# Altium schematic sheet BRZ_PDU.SchDoc
size C; SheetNumber: 1; SheetTotal: 4
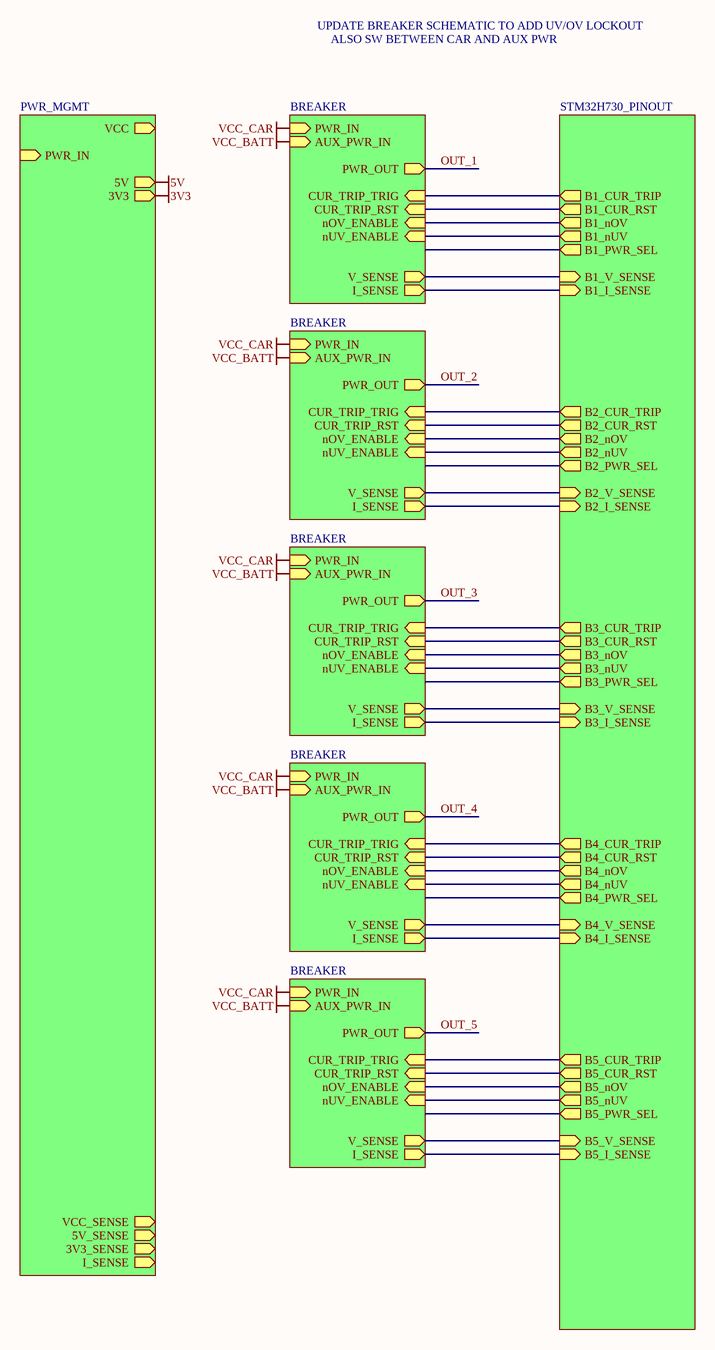
[diagram p0: BRZ_PDU.SchDoc]

## Sub-sheets
BREAKER_0 = BREAKER: PWR_IN (in), PWR_OUT (out), CUR_TRIP_RST (in), V_SENSE (out), I_SENSE (out), CUR_TRIP_TRIG (in), nOV_ENABLE (in), nUV_ENABLE (in), AUX_PWR_IN (in)
BREAKER_0 = BREAKER: PWR_IN (in), PWR_OUT (out), CUR_TRIP_RST (in), V_SENSE (out), I_SENSE (out), CUR_TRIP_TRIG (in), AUX_PWR_IN (in), nOV_ENABLE (in), nUV_ENABLE (in)
BREAKER_0 = BREAKER: PWR_IN (in), PWR_OUT (out), CUR_TRIP_RST (in), V_SENSE (out), I_SENSE (out), CUR_TRIP_TRIG (in), AUX_PWR_IN (in), nOV_ENABLE (in), nUV_ENABLE (in)
BREAKER_0 = BREAKER: PWR_IN (in), PWR_OUT (out), CUR_TRIP_RST (in), V_SENSE (out), I_SENSE (out), CUR_TRIP_TRIG (in), AUX_PWR_IN (in), nOV_ENABLE (in), nUV_ENABLE (in)
BREAKER_0 = BREAKER: PWR_IN (in), PWR_OUT (out), CUR_TRIP_RST (in), V_SENSE (out), I_SENSE (out), CUR_TRIP_TRIG (in), AUX_PWR_IN (in), nOV_ENABLE (in), nUV_ENABLE (in)
MCU = STM32H730_PINOUT: B1_CUR_TRIP (out), B1_CUR_RST (out), B1_nOV (out), B1_nUV (out), B1_PWR_SEL (out), B1_V_SENSE (in), B1_I_SENSE (in), B2_CUR_TRIP (out), B2_CUR_RST (out), B2_nOV (out), B2_nUV (out), B2_PWR_SEL (out), B2_V_SENSE (in), B2_I_SENSE (in), B3_CUR_TRIP (out), B3_CUR_RST (out), B3_nOV (out), B3_nUV (out), B3_PWR_SEL (out), B3_V_SENSE (in), B3_I_SENSE (in), B4_CUR_TRIP (out), B4_CUR_RST (out), B4_nOV (out), B4_nUV (out), B4_PWR_SEL (out), B4_V_SENSE (in), B4_I_SENSE (in), B5_CUR_TRIP (out), B5_CUR_RST (out), B5_nOV (out), B5_nUV (out), B5_PWR_SEL (out), B5_V_SENSE (in), B5_I_SENSE (in)
PWR_MGMT = PWR_MGMT: PWR_IN (in), 5V (out), 3V3 (out), VCC_SENSE (out), 5V_SENSE (out), 3V3_SENSE (out), I_SENSE (out), VCC (out)

## Nets
3V3: sheet PWR_MGMT/3V3
5V: sheet PWR_MGMT/5V
VCC_BATT: sheet BREAKER_0/AUX_PWR_IN, sheet BREAKER_0/AUX_PWR_IN, sheet BREAKER_0/AUX_PWR_IN, sheet BREAKER_0/AUX_PWR_IN, sheet BREAKER_0/AUX_PWR_IN
VCC_CAR: sheet BREAKER_0/PWR_IN, sheet BREAKER_0/PWR_IN, sheet BREAKER_0/PWR_IN, sheet BREAKER_0/PWR_IN, sheet BREAKER_0/PWR_IN
OUT_1: sheet BREAKER_0/PWR_OUT
OUT_2: sheet BREAKER_0/PWR_OUT
OUT_3: sheet BREAKER_0/PWR_OUT
OUT_4: sheet BREAKER_0/PWR_OUT
OUT_5: sheet BREAKER_0/PWR_OUT
(unnamed): sheet BREAKER_0/CUR_TRIP_RST, sheet MCU/B1_CUR_RST
(unnamed): sheet BREAKER_0/V_SENSE, sheet MCU/B1_V_SENSE
(unnamed): sheet BREAKER_0/I_SENSE, sheet MCU/B1_I_SENSE
(unnamed): sheet BREAKER_0/CUR_TRIP_TRIG, sheet MCU/B1_CUR_TRIP
(unnamed): sheet BREAKER_0/nOV_ENABLE, sheet MCU/B1_nOV
(unnamed): sheet BREAKER_0/nUV_ENABLE, sheet MCU/B1_nUV
(unnamed): sheet MCU/B2_CUR_TRIP, sheet BREAKER_0/CUR_TRIP_TRIG
(unnamed): sheet MCU/B2_CUR_RST, sheet BREAKER_0/CUR_TRIP_RST
(unnamed): sheet MCU/B2_nOV, sheet BREAKER_0/nOV_ENABLE
(unnamed): sheet MCU/B2_nUV, sheet BREAKER_0/nUV_ENABLE
(unnamed): sheet MCU/B2_V_SENSE, sheet BREAKER_0/V_SENSE
(unnamed): sheet MCU/B2_I_SENSE, sheet BREAKER_0/I_SENSE
(unnamed): sheet MCU/B3_CUR_TRIP, sheet BREAKER_0/CUR_TRIP_TRIG
(unnamed): sheet MCU/B3_CUR_RST, sheet BREAKER_0/CUR_TRIP_RST
(unnamed): sheet MCU/B3_nOV, sheet BREAKER_0/nOV_ENABLE
(unnamed): sheet MCU/B3_nUV, sheet BREAKER_0/nUV_ENABLE
(unnamed): sheet MCU/B3_V_SENSE, sheet BREAKER_0/V_SENSE
(unnamed): sheet MCU/B3_I_SENSE, sheet BREAKER_0/I_SENSE
(unnamed): sheet MCU/B4_CUR_TRIP, sheet BREAKER_0/CUR_TRIP_TRIG
(unnamed): sheet MCU/B4_CUR_RST, sheet BREAKER_0/CUR_TRIP_RST
(unnamed): sheet MCU/B4_nOV, sheet BREAKER_0/nOV_ENABLE
(unnamed): sheet MCU/B4_nUV, sheet BREAKER_0/nUV_ENABLE
(unnamed): sheet MCU/B4_V_SENSE, sheet BREAKER_0/V_SENSE
(unnamed): sheet MCU/B4_I_SENSE, sheet BREAKER_0/I_SENSE
(unnamed): sheet MCU/B5_CUR_TRIP, sheet BREAKER_0/CUR_TRIP_TRIG
(unnamed): sheet MCU/B5_CUR_RST, sheet BREAKER_0/CUR_TRIP_RST
(unnamed): sheet MCU/B5_nOV, sheet BREAKER_0/nOV_ENABLE
(unnamed): sheet MCU/B5_nUV, sheet BREAKER_0/nUV_ENABLE
(unnamed): sheet MCU/B5_V_SENSE, sheet BREAKER_0/V_SENSE
(unnamed): sheet MCU/B5_I_SENSE, sheet BREAKER_0/I_SENSE

## Notes on the sheet
- UPDATE BREAKER SCHEMATIC TO ADD UV/OV LOCKOUT
- ALSO SW BETWEEN CAR AND AUX PWR